# EAGLE design Sandy R1 (EAGLE 7.2.0)
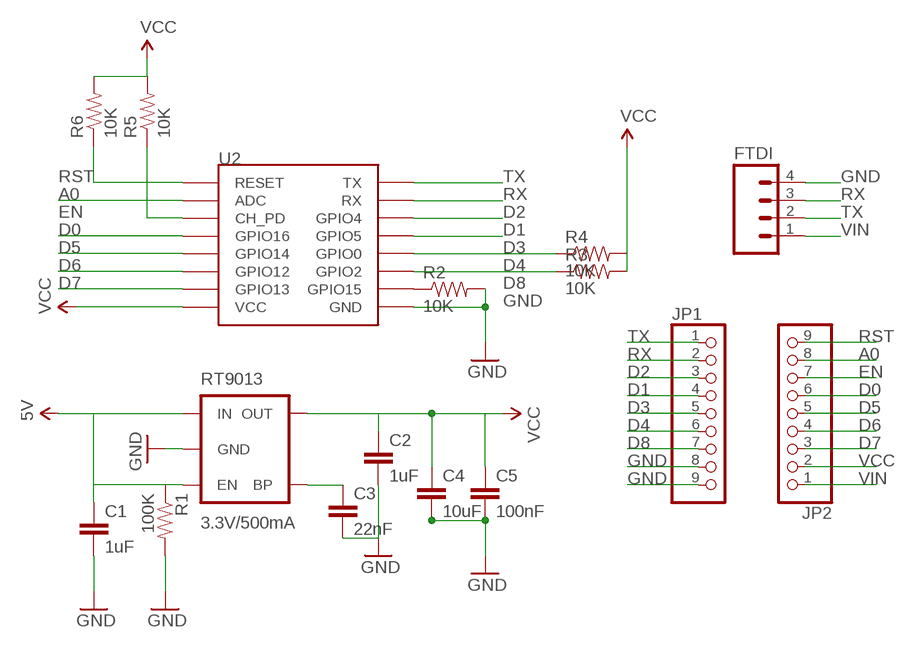
[diagram p0: schematic, sheet 1]

## Parts
C1  1uF  CAP0805  [0805]
C2  1uF  22UF-6.3V-20%(0805)  [0805]
C3  22nF  CAP0805  [0805]
C4  10uF  CAP0805  [0805]
C5  100nF  22UF-6.3V-20%(0805)  [0805]
FTDI  M04PTH  [1X04]
JP1  PINHD-1X9  [1X09-BIG]
JP2  PINHD-1X9  [1X09-BIG]
R1  100K  RESISTOR0805-RES  [0805]
R2  10K  RESISTOR0805-RES  [0805]
R3  10K  RESISTOR0805-RES  [0805]
R4  10K  RESISTOR0805-RES  [0805]
R5  10K  RESISTOR0805-RES  [0805]
R6  10K  RESISTOR0805-RES  [0805]
RT9013  3.3V/500mA  V_REG_MIC52053.3V  [SOT23-5]
U2  ESP12THROUGHOLE  [ESP12]

## Nets
A0: JP2.8 U2.ADC
BP: C3.1 RT9013.4(BP)
D0: JP2.6 U2.GPIO16
D1: JP1.4 U2.GPIO5
D2: JP1.3 U2.GPIO4
D3: JP1.5 R4.1 U2.GPIO0
D4: JP1.6 R3.1 U2.GPIO2
D5: JP2.5 U2.GPIO14
D6: JP2.4 U2.GPIO12
D7: JP2.3 U2.GPIO13
D8: JP1.7 R2.1 U2.GPIO15
EN: JP2.7 R5.1 U2.CH_PD
GND: C1.2 C2.2 C3.2 C4.2 C5.2 FTDI.4 JP1.8 JP1.9 R1.2 R2.2 RT9013.2(GND) U2.GND
RST: JP2.9 R6.1 U2.RESET
RX: FTDI.3 JP1.2 U2.RX
TX: FTDI.2 JP1.1 U2.TX
VCC: C2.1 C4.1 C5.1 JP2.2 R3.2 R4.2 R5.2 R6.2 RT9013.5(OUT) U2.VCC
VIN: C1.1 FTDI.1 JP2.1 R1.1 RT9013.1(IN) RT9013.3(EN) ; supply symbol labelled 5V

## Library data of the parts
C1 C3 C4 = SparkFun-Passives:CAP: Capacitor Standard 0603 ceramic capacitor, and 0.1" leaded capacitor.
C2 C5 = SparkFun-Capacitors:22UF-6.3V-20%(0805): CAP-08402 Ceramic; PROD_ID: CAP-08402; VALUE: 22uF
FTDI = SparkFun-Connectors:M04: Header 4 Standard 4-pin 0.1" header. Use with straight break away headers (SKU : PRT-00116), right angle break away headers (PRT-00553), swiss pins (PRT-00743), machine pins (PRT-00117), and female headers (PRT-00115). Molex polarized connector foot print use with SKU : PRT-08231 with associated crimp pins and housings. 1MM SMD Version SKU: PRT-10208
JP1 JP2 = adafruit:PINHD-1X9: Pin header 1x10 0.1" spacing With round pins
R1-R6 = SparkFun-Passives:RESISTOR: Resistor Basic schematic elements and footprints for 0603, 1206, and PTH resistors.
RT9013 = SparkFun-PowerIC:V_REG_MIC5205: V_REG MIC5205 Standard 3.3V, 5V, and Adjustable 150mA LDO voltage regulator in SOT-23 layout. Micrel part MIC5205. BP (by-pass) pin is used to lower output noise with 470pF cap, may be left open. On the adjustable version BP is used to set output.; PROD_ID: VREG-00822; VALUE: 3.3V/150mA
U2 = esp8266modules:ESP12: ESP8266 Wifi module 12

## Board
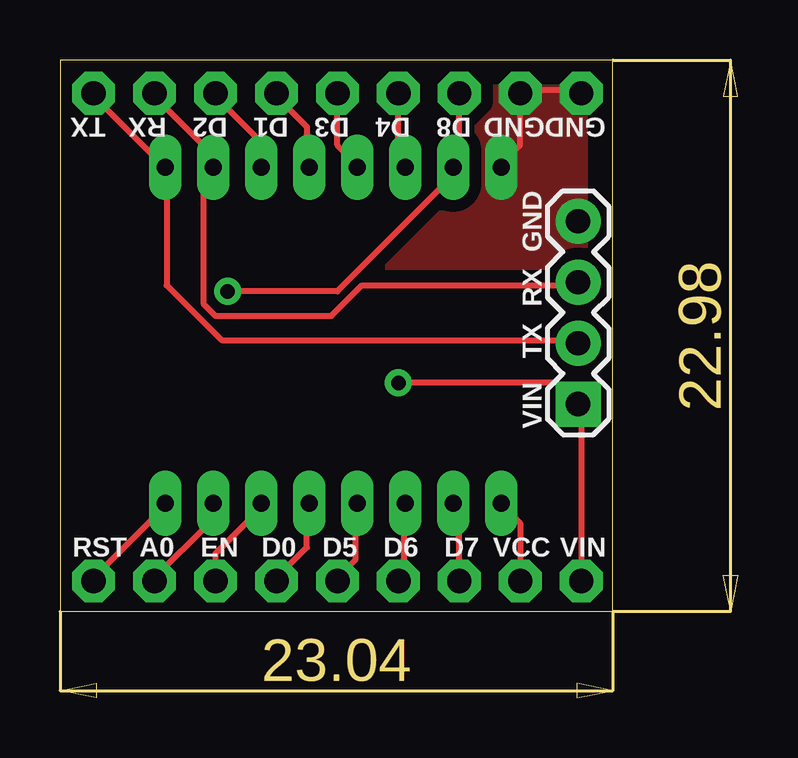
[diagram p1: board, top side]
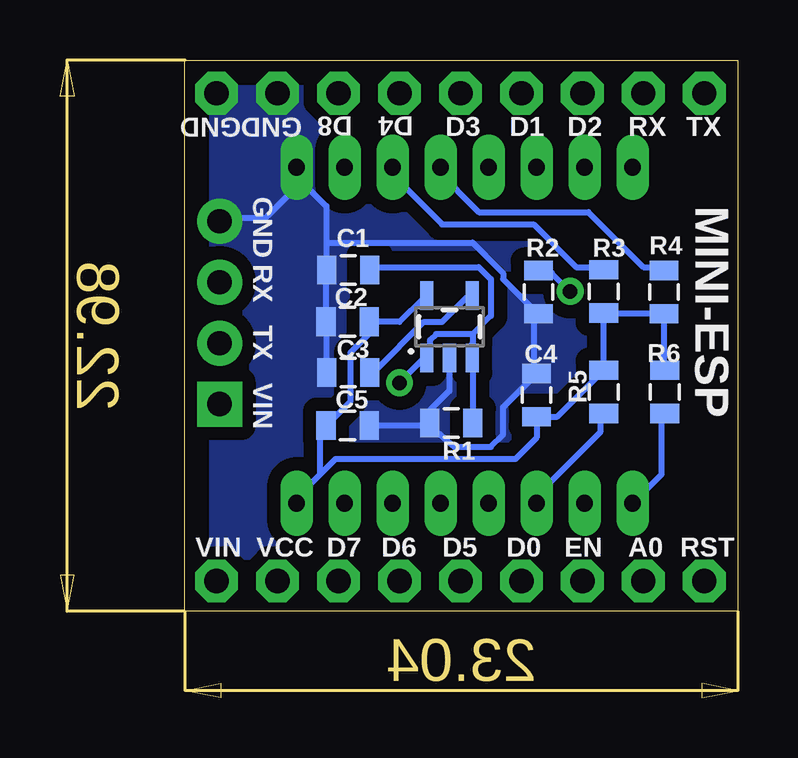
[diagram p2: board, bottom side, seen from below]

Size 23.04 x 22.98 mm. Coordinates in mm from the lower left corner, seen from the top.
Outline: 0,22.98 0,0 23.04,0 23.04,22.98 0,22.98
Copper layers (1*16): Top 0.035mm / dielectric 1.5mm / Bottom 0.035mm
Design rules "default *": minimum track width 10mil, minimum drill 24mil, track to track 10mil, track to pad 10mil, pad to pad 10mil, via to via 10mil, smd to smd 10mil, copper to edge 40mil, drill to drill 10mil, minimum pad ring 13mil, minimum via ring 10mil, stop-mask expansion 4mil, vias tented up to drill 0mil, thermal gap 10mil

### Footprints (pad centres in the part's own frame; a part is rotated, then mirrored left to right if it is on the bottom)
0805 = smd 0.8 x 1.2: 1 -0.9,0; 2 0.9,0
1X04 = drill 1.016 pad 1.88 square: 1 0,0 | drill 1.016 pad 1.88: 2 2.54,0; 3 5.08,0; 4 7.62,0
1X09-BIG = drill 1.016 pad 1.778 octagon: 1 -10.16,0; 2 -7.62,0; 3 -5.08,0; 4 -2.54,0; 5 0,0; 6 2.54,0; 7 5.08,0; 8 7.62,0; 9 10.16,0
SOT23-5 = smd 0.55 x 1.2: 1 -0.95,-1.3; 2 0,-1.3; 3 0.95,-1.3; 4 0.95,1.3; 5 -0.95,1.3
ESP12 = drill 0.7 long: ADC -7.1,3.8; CH_PD -7.1,1.8; GND 6.9,-8.2; GPIO0 6.9,-2.2; GPIO2 6.9,-4.2; GPIO4 6.9,1.8; GPIO5 6.9,-0.2; GPIO12 -7.1,-4.2; GPIO13 -7.1,-6.2; GPIO14 -7.1,-2.2; GPIO15 6.9,-6.2; GPIO16 -7.1,-0.2; RESET -7.1,5.8; RX 6.9,3.8; TX 6.9,5.8; VCC -7.1,-8.2

### Placement (x,y rotation side)
C1  16.23,14.22 180 bottom
C2  16.26,12.06 180 bottom
C3  16.23,9.96 180 bottom
C4  8.38,9.02 90 bottom
C5  16.26,7.75 0 bottom
FTDI  21.59,8.64 90 top
JP1  11.56,21.59 0 top
JP2  11.56,1.27 180 top
R1  11.94,7.85 180 bottom
R2  8.31,13.31 270 bottom
R3  5.59,13.33 270 bottom
R4  3.07,13.31 270 bottom
R5  5.59,9.14 90 bottom
R6  3.05,9.14 90 bottom
RT9013  12.01,11.86 0 bottom
U2  10.19,11.61 90 top

### Tracks (layer width: path | path; a pad name or v marks a point on that pad's centre or on a via)
A0
  Top 0.254: U2.ADC 6.22,4.45 6.22,3.68 3.94,1.4 JP2.8
BP
  Bottom 0.254: RT9013.4 11.3,13.08 12.32,12.06 13.08,12.06 15.11,10.03 C3.1
D0
  Top 0.254: U2.GPIO16 10.29,4.45 10.29,2.67 9.02,1.4 JP2.6
D1
  Top 0.254: U2.GPIO5 10.29,18.67 10.29,20.19 9.02,21.46 JP1.4
D2
  Top 0.254: U2.GPIO4 8.25,18.67 8.25,19.68 6.48,21.46 JP1.3
D3
  Top 0.254: JP1.5 11.56,19.43 12.32,18.67 U2.GPIO0
  Bottom 0.254: R4.1 3.17,14.35 3.94,14.35 6.22,16.64 10.79,16.64 12.57,18.41 U2.GPIO0
D4
  Top 0.254: JP1.6 14.1,18.92 14.35,18.67 U2.GPIO2
  Bottom 0.254: R3.1 5.72,14.35 6.73,14.35 8.51,16.13 12.32,16.13 14.61,18.41 U2.GPIO2
D5
  Top 0.254: U2.GPIO14 12.32,4.45 12.32,2.16 11.56,1.4 JP2.5
D6
  Top 0.254: U2.GPIO12 14.35,4.45 14.35,1.65 14.1,1.4 JP2.4
D7
  Top 0.254: JP2.3 16.64,4.45 U2.GPIO13
D8  (via drill 0.61)
  Top 0.254: v6.99,13.33 11.56,13.33 16.64,18.41 U2.GPIO15 16.64,18.67 JP1.7
  Bottom 0.254: v6.99,13.33 7.75,14.1 8.25,14.1 R2.1
EN
  Top 0.254: JP2.7 6.48,2.41 8.51,4.45 U2.CH_PD
  Bottom 0.254: R5.1 5.72,8 5.72,7.49 8.51,4.7 U2.CH_PD
GND
  Top 0.254: JP1.9 21.72,21.72 19.18,21.72 JP1.8 19.18,19.43 18.41,18.67 U2.GND
  Bottom 0.254: 13.08,7.75 C5.2 | 12.83,7.75 11.81,6.86 10.29,6.86 9.78,7.37 9.78,8.51 8.51,9.78 C4.2 8.51,10.03 8.51,12.32 R2.2 8.51,12.57 9.78,13.84 9.78,14.1 11.05,15.37 17.14,15.37 | C2.2 17.14,10.03 C3.2 | C2.2 17.14,14.1 C1.2 17.14,14.35 17.14,15.37 | C2.2 | 17.14,15.37 17.14,16.89 18.16,17.91 | 18.16,17.91 18.16,18.41 U2.GND 18.16,17.91 | 18.16,17.91 19.68,16.38 21.46,16.38 FTDI.4 | RT9013.2 12.01,9.2 12.83,8.38 12.83,7.86 R1.2
  pour Bottom (isolate 0.559, no thermals): -1.52,25.15 24.51,25.15 24.51,-1.9 -1.52,-1.9
  pour Top (isolate 0.508, no thermals): -1.52,25.15 24.51,25.15 24.51,-1.9 -1.52,-1.9
RST
  Top 0.254: JP2.9 1.4,1.4 4.44,4.45 U2.RESET
  Bottom 0.254: R6.1 3.17,8 3.17,5.72 4.19,4.7 U2.RESET
RX
  Top 0.254: JP1.2 3.94,21.46 6.22,19.18 6.22,18.67 U2.RX 6.22,18.41 5.97,18.16 5.97,12.83 6.48,12.32 11.3,12.32 12.57,13.59 21.46,13.59 FTDI.3
TX
  Top 0.254: JP1.1 1.4,21.46 4.19,18.67 U2.TX 4.44,18.41 4.44,13.59 6.73,11.3 21.46,11.3 FTDI.2
VCC
  Top 0.254: JP2.2 19.18,3.68 18.41,4.45 U2.VCC
  Bottom 0.254: RT9013.5 13.08,13.08 14.1,12.06 C2.1 15.37,11.56 16.13,10.79 16.13,8.76 C5.1 17.4,7.75 17.4,5.72 | 17.4,5.72 18.41,4.7 U2.VCC | 17.4,5.72 16.76,6.35 9.27,6.35 8.38,7.24 C4.1 7.51,8.12 R5.2 R3.2 3.1,12.44 R4.2 3.07,10.07 R6.2
VIN  (via drill 0.61)
  Top 0.254: JP2.1 21.72,8.51 FTDI.1 20.7,9.53 v14.1,9.53
  Bottom 0.254: 11.05,11.56 12.57,11.56 12.83,11.3 12.83,10.79 RT9013.1 13.08,10.54 v14.1,9.53 | 11.05,11.56 10.29,12.32 10.29,13.84 10.79,14.35 15.11,14.35 C1.1 | 11.05,11.56 11.04,11.56 11.04,11.18 | 11.04,11.18 R1.1 | RT9013.3 11.06,11.15 11.04,11.18

### Text on the board
tNames: TX | RX | D2 | D1 | D3 | D4 | D8 | GND | GND | GND | RX | TX | VIN | RST | A0 | EN | D0 | D5 | D6 | D7 | VCC | VIN
bNames: D4 | D8 | GND | GND | TX | RX | D2 | D1 | D3 | MINI-ESP | GND | RX | TX | VIN | RST | A0 | EN | D0 | D5 | D6 | D7 | VCC | VIN